# Altium schematic sheet MagnetWaterSystem.SchDoc
size A
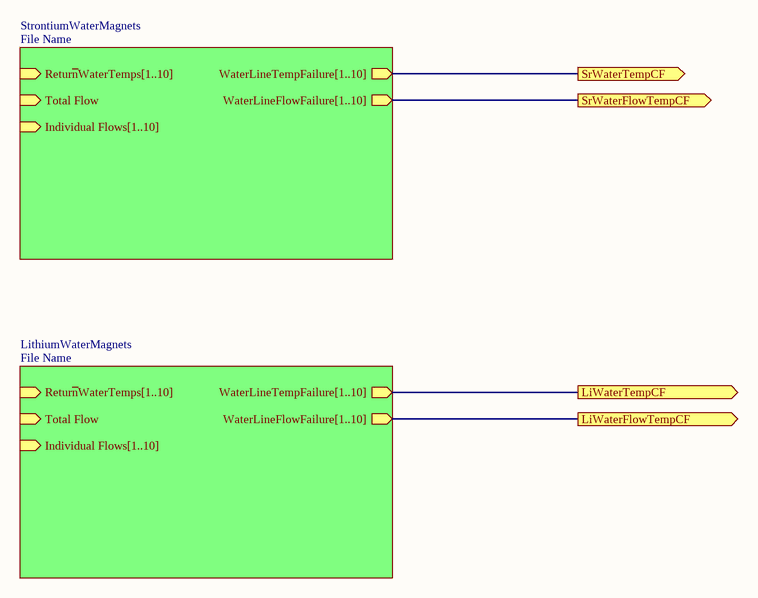
[diagram p0: MagnetWaterSystem.SchDoc]

## Sub-sheets
LithiumWaterMagnets = File Name: Retur~{n}WaterTemps[1..10] (in), Total Flow (in), Individual Flows[1..10] (in), WaterLineTempFailure[1..10] (out), WaterLineFlowFailure[1..10] (out)
StrontiumWaterMagnets = File Name: Retur~{n}WaterTemps[1..10] (in), Total Flow (in), Individual Flows[1..10] (in), WaterLineTempFailure[1..10] (out), WaterLineFlowFailure[1..10] (out)

## Ports
LiWaterFlowTempCF (out), LiWaterTempCF (out), SrWaterFlowTempCF (out), SrWaterTempCF (out)

## Nets
LiWaterFlowTempCF: port LiWaterFlowTempCF, sheet LithiumWaterMagnets/WaterLineFlowFailure[1..10]
LiWaterTempCF: port LiWaterTempCF, sheet LithiumWaterMagnets/WaterLineTempFailure[1..10]
SrWaterFlowTempCF: port SrWaterFlowTempCF, sheet StrontiumWaterMagnets/WaterLineFlowFailure[1..10]
SrWaterTempCF: port SrWaterTempCF, sheet StrontiumWaterMagnets/WaterLineTempFailure[1..10]